# Altium schematic sheet Power Supply.SchDoc
size A
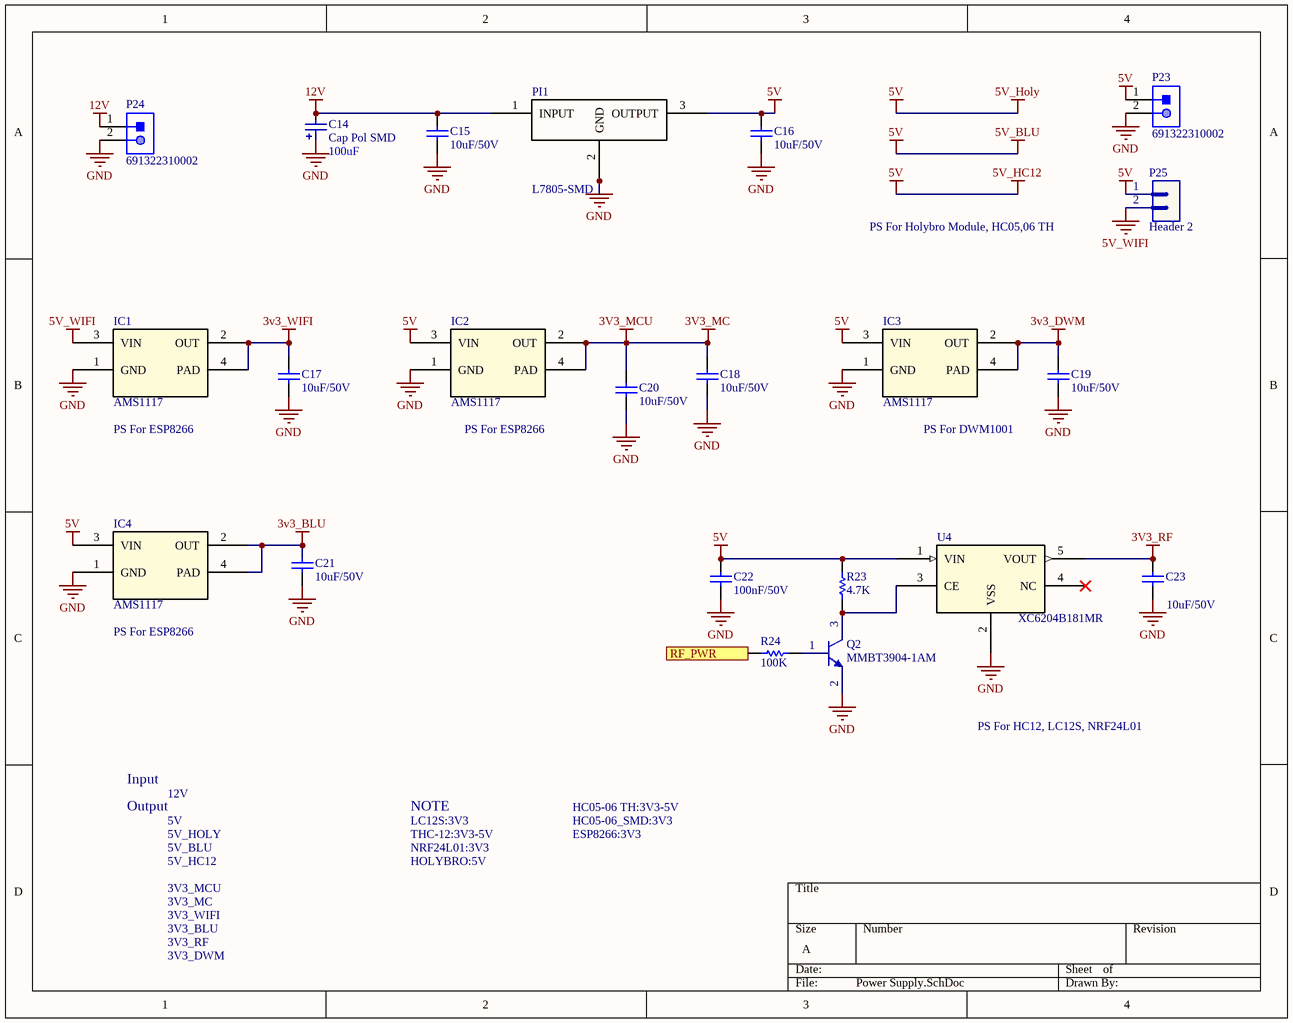
[diagram p0: Power Supply.SchDoc]

## Parts
C14  Cap Pol SMD  value 100uF  [CAP ALU SIZE B]
C15  value 10uF/50V  [CAP-SM-0805]  (hidden comment: Cap-10uF-50V-0805)
C16  value 10uF/50V  [CAP-SM-0805]  (hidden comment: Cap-10uF-50V-0805)
C17  value 10uF/50V  [CAP-SM-0805]  (hidden comment: Cap-10uF-50V-0805)
C18  value 10uF/50V  [CAP-SM-0805]  (hidden comment: Cap-10uF-50V-0805)
C19  value 10uF/50V  [CAP-SM-0805]  (hidden comment: Cap-10uF-50V-0805)
C20  value 10uF/50V  [CAP-SM-0805]  (hidden comment: Cap-10uF-50V-0805)
C21  value 10uF/50V  [CAP-SM-0805]  (hidden comment: Cap-10uF-50V-0805)
C22  value 100nF/50V  [CAP-SM-0805]  (hidden comment: Cap-100nF-50V-0805)
C23  value 10uF/50V  [CAP-SM-0805]  (hidden comment: Cap-10uF-50V-0805)
IC1  AMS1117  [AMS1117]
IC2  AMS1117  [AMS1117]
IC3  AMS1117  [AMS1117]
IC4  AMS1117  [AMS1117]
P23  691322310002  [691322310002]
P24  691322310002  [691322310002]
P25  Header 2  [JP2]
PI1  L7805-SMD  [D2PAk]
Q2  MMBT3904-1AM  [SOT23_NEX]
R23  value 4.7K  [RES-SM-0805]  (hidden comment: Res-1K-0805)
R24  value 100K  [RES-SM-0805]  (hidden comment: Res-1K-0805)
U4  XC6204B181MR  [XC6204B332MR]

## Ports
RF_PWR (in)

## Nets
3v3_BLU: C21.2 IC4.2(OUT) IC4.4(PAD)
3v3_DWM: C19.2 IC3.2(OUT) IC3.4(PAD)
3V3_MC: C18.2 C20.2 IC2.2(OUT) IC2.4(PAD)  [also labelled 3V3_MCU]
3V3_RF: C23.2 U4.5(VOUT)
3v3_WIFI: C17.2 IC1.2(OUT) IC1.4(PAD)
5V: C16.2 C22.2 IC2.3(VIN) IC3.3(VIN) IC4.3(VIN) P23.1 P25.1 PI1.3(OUTPUT) R23.2 U4.1(VIN)  [also labelled 5V_BLU, 5V_HC12, 5V_Holy]
5V_WIFI: IC1.3(VIN) P25.2
12V: C14.2 C15.2 P24.1 PI1.1(INPUT)
GND: C14.1 C15.1 C16.1 C17.1 C18.1 C19.1 C20.1 C21.1 C22.1 C23.1 IC1.1(GND) IC2.1(GND) IC3.1(GND) IC4.1(GND) P23.2 P24.2 PI1.2(GND) Q2.2(E) U4.2(VSS)
RF_PWR: R24.2 ; port RF_PWR
NetQ2_1: Q2.1(B) R24.1
NetQ2_3: Q2.3(C) R23.1 U4.3(CE)

Not connected (* = marked no-connect by the designer): U4 4(NC)*

## Notes on the sheet
- PS For Holybro Module, HC05,06 TH
- PS For ESP8266
- PS For DWM1001
- PS For HC12, LC12S, NRF24L01
- Input
- Output
- 12V
- 5V
- 5V_HOLY
- NOTE
- LC12S:3V3
- THC-12:3V3-5V
- HC05-06 TH:3V3-5V
- HC05-06_SMD:3V3
- ESP8266:3V3
- 5V_BLU
- 5V_HC12
- 3V3_MCU
- 3V3_MC
- NRF24L01:3V3
- HOLYBRO:5V
- 3V3_WIFI
- 3V3_BLU
- 3V3_RF
- 3V3_DWM

## Library data of the parts
C14 = Cap Pol SMD: Polarized Capacitor (Radial)
C15-C21 C23 = Cap-10uF-50V-0805: CAP CER 10UF 50V X5R 0805; Manufacturer: Yageo; Manufacturer Part Number: CC0805KKX5R9BB106; Local Supplier: thegioiic; Local Supplier Link: https://thegioiic.com/products/tu-10uf-50v-0805; Supplier 1: Digikey; Supplier 1 Link: https://www.digikey.com/product-detail/en/yageo/CC0805KKX5R9BB106/311-3499-2-ND/7164383; Supplier 1 Part Number: 311-3499-2-ND
C22 = Cap-100nF-50V-0805: CAP CER 0.1UF 50V Y5V 0805; Manufacturer: Samsung Electro-Mechanics; Manufacturer Part Number: CL21F104ZBCNNNC; Local Supplier: thegioiic; Local Supplier Link: https://thegioiic.com/products/tu-100nf-0-1uf-50v-0805; Supplier 1: Digikey; Supplier 1 Part Number: 1276-1007-1-ND; Supplier 1 Link: https://www.digikey.com/product-detail/en/samsung-electro-mechanics/CL21F104ZBCNNNC/1276-1007-1-ND/3889093
IC1-IC4 = AMS1117: Vendor: Advanced Monolithic Systems; Built_By: EMA_Matt; SourceLibrary: Advanced_Monolithic_Systems_10-16-2019; Copyright: Copyright (C) 2018 Accelerated Designs. All rights reserved; Manufacturer_Part_Number: AMS1117; RefDes: RefDes; Type: DEV
P23 P24 = 691322310002: WR-TBL Serie 322 Horizontal PCB Header, Pluggable, pitch 3.81mm, 2p; Compliance: RoHS; Modularity: No; Pin Number: 2; Rated Current [UL]: 10A; Working Voltage [UL]: 300VAC; ComponentLink1Description: Manufacturer; ComponentLink1URL: http://www.we-online.de; ComponentLink2URL: https://katalog.we-online.de/em/datasheet/691322310002.pdf; ComponentLink2Description: Datasheet; Mounting Technology: THT; Part Number: 691322310002; Packaging: Box; Operating Temperature: -40 to +105degC; PCB/Cable/Panel: PCB; Pitch: 3.81mm; Published Date: October 2019; Type: Horizontal; Publisher: Wurth Elektronik; Application: Pluggable
P25 = Header 2: Header, 2-Pin; LatestRevisionDate: 17-Jul-2002; LatestRevisionNote: Re-released for DXP Platform.; Publisher: Altium Limited
PI1 = L7805-SMD_1: Manufacturer_Part_Number: L7805CD2T-TR; Vendor: STMicroelectronics; Built_By: EMA_UL_Team; Copyright: Copyright (C) 2018 Accelerated Designs. All rights reserved; RefDes: RefDes; Type: DEV
R23 R24 = Res-1K-0805: RES 1K OHM 1% 1/4W 0805; Manufacturer: Stackpole Electronics Inc; Manufacturer Part Number: RNCP0805FTD1K00; Local Supplier: thegioiic; Local Supplier Link: https://thegioiic.com/products/dien-tro-1k-ohm-0805-5; Supplier 1: Digikey; Supplier 1 Link: https://www.digikey.com/product-detail/en/stackpole-electronics-inc/RNCP0805FTD1K00/RNCP0805FTD1K00CT-ND/2240568; Supplier 1 Part Number: RNCP0805FTD1K00CT-ND
U4 = XC6204B181MR: Vendor: Torex Semiconductor; Built_By: EMA_UL_Team; SourceLibrary: Torex_2016-07-05_1; Manufacturer_Part_Number: XC6204B181MR; Copyright: Copyright (C) 2018 Accelerated Designs. All rights reserved; RefDes: RefDes; Type: DEV